# EAGLE design main (EAGLE 6.5.0)
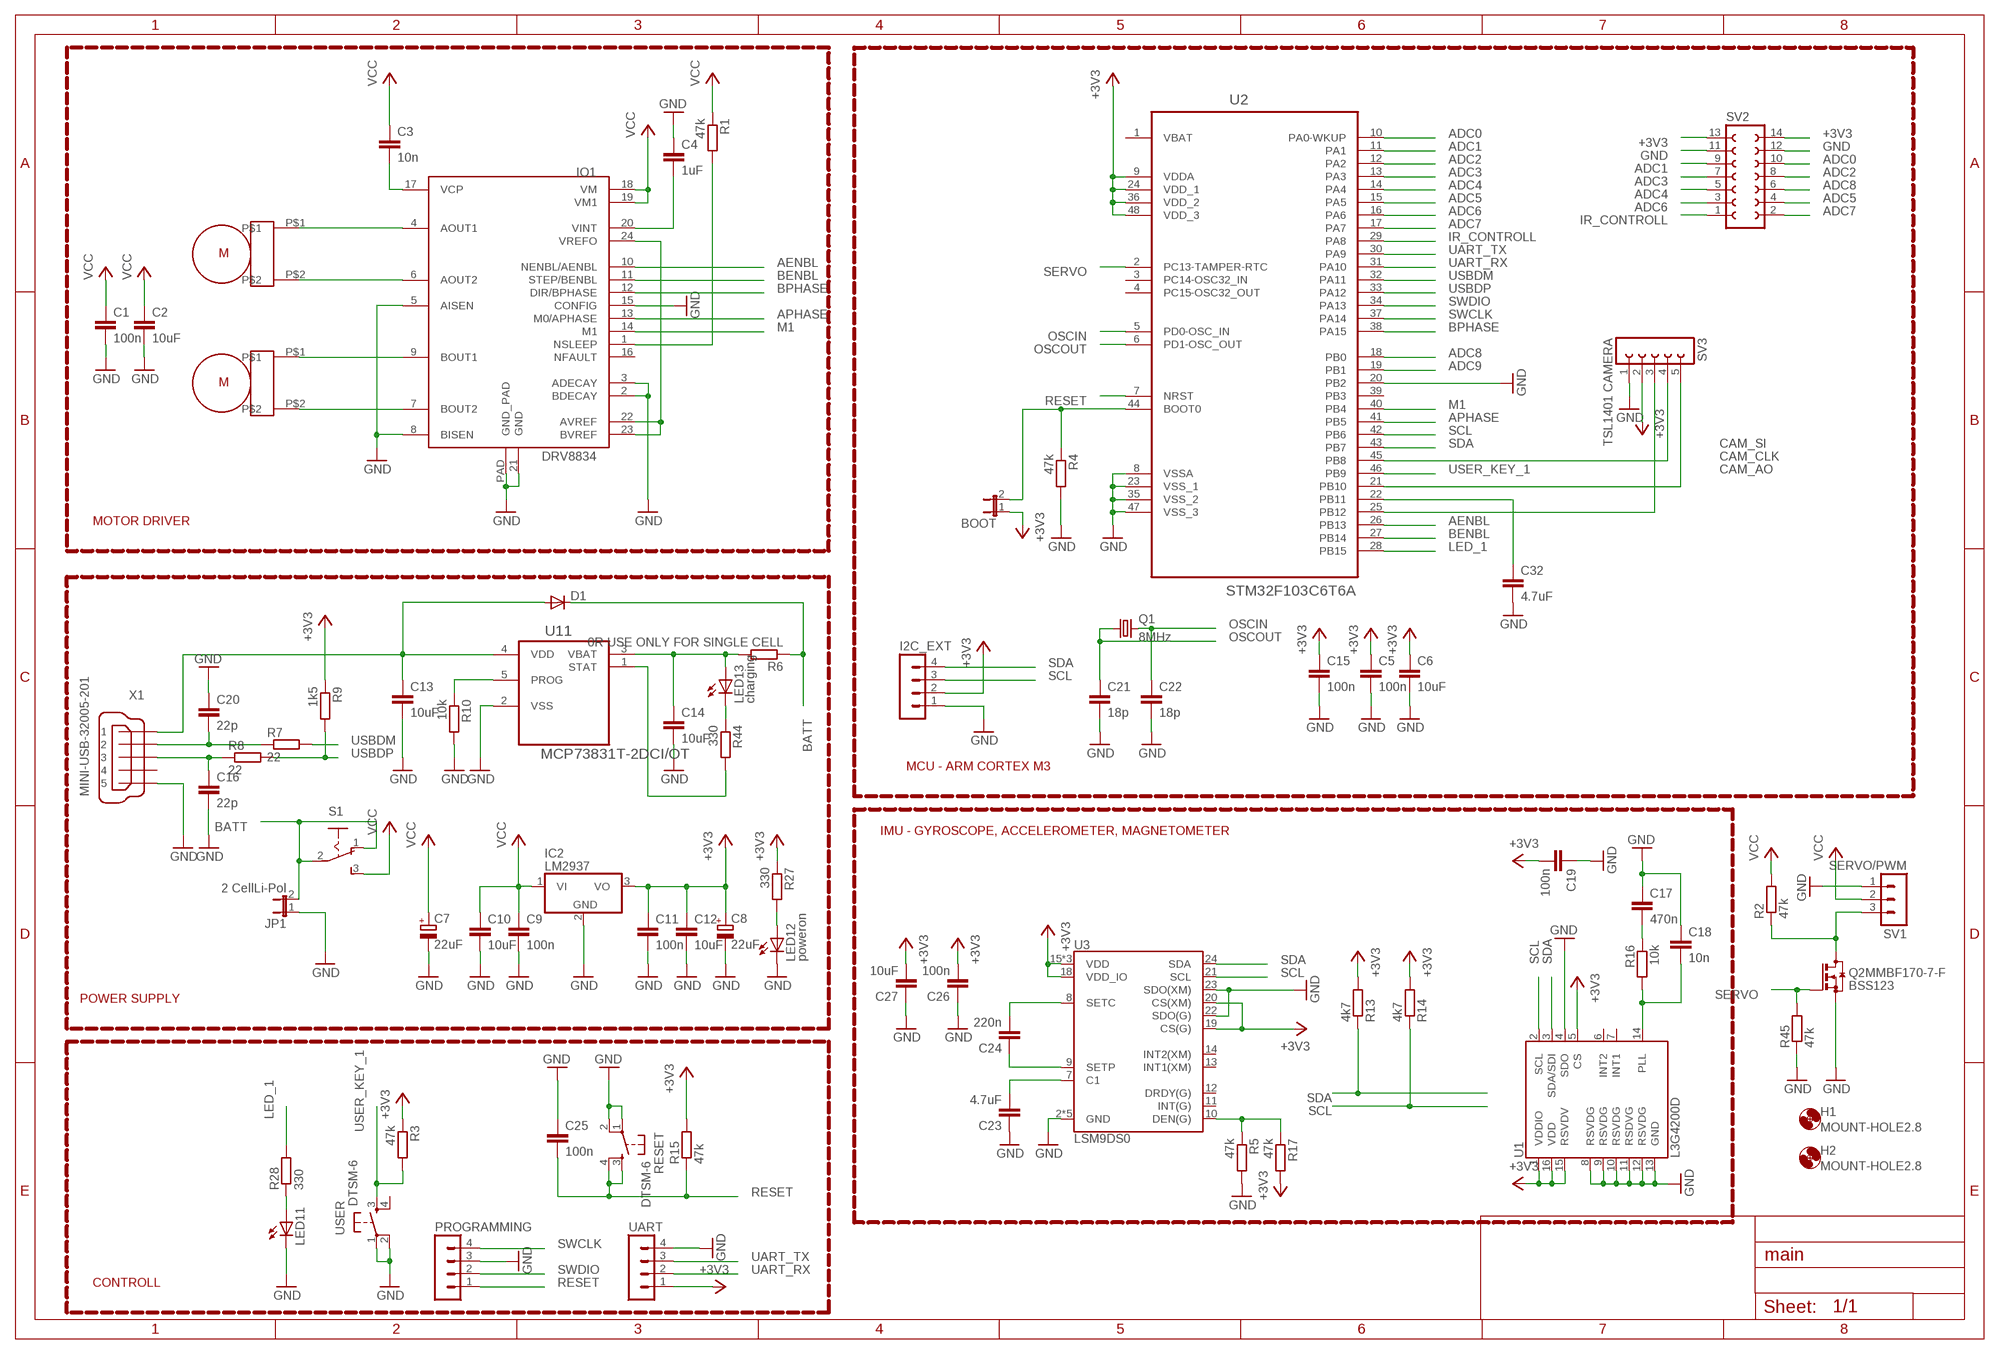
[diagram p0: schematic, sheet 1]

## Parts
BOOT  JP1E  [JP1]
C1  100n  C-EUC1206  [C1206]
C2  10uF  C-EUC1206  [C1206]
C3  10n  C-EUC1206  [C1206]
C4  1uF  C-EUC1206  [C1206]
C5  100n  C-EUC0805  [C0805]
C6  10uF  C-EUC0805  [C0805]
C7  22uF  CPOL-EU153CLV-0505  [153CLV-0505]
C8  22uF  CPOL-EU153CLV-0505  [153CLV-0505]
C9  100n  C-EUC0805  [C0805]
C10  10uF  C-EUC0805  [C0805]
C11  100n  C-EUC0805  [C0805]
C12  10uF  C-EUC0805  [C0805]
C13  10uF  C-EUC0805  [C0805]
C14  10uF  C-EUC0805  [C0805]
C15  100n  C-EUC0805  [C0805]
C16  22p  C-EUC0805  [C0805]
C17  470n  C-EUC0805  [C0805]
C18  10n  C-EUC0805  [C0805]
C19  100n  C-EUC0805  [C0805]
C20  22p  C-EUC0805  [C0805]
C21  18p  C-EUC0805  [C0805]
C22  18p  C-EUC0805  [C0805]
C23  4.7uF  C-EUC0805  [C0805]
C24  220n  C-EUC0805  [C0805]
C25  100n  C-EUC0805  [C0805]
C26  100n  C-EUC0805  [C0805]
C27  10uF  C-EUC0805  [C0805]
C32  4.7uF  C-EUC0805  [C0805]
D1  DIODE-SMB  [SMB]
H1  MOUNT-HOLE2.8  [2,8]
H2  MOUNT-HOLE2.8  [2,8]
I2C_EXT  MA04-1  [MA04-1]
IC2  LM2937  [TO263-3]
IO1  DRV8834  [DRV8834_PCK]
JP1  2 CellLi-Pol  JP1E  [JP1]
LED11  LEDCHIPLED_1206  [CHIPLED_1206]
LED12  poweron  LEDCHIPLED_1206  [CHIPLED_1206]
LED13  charging  LEDCHIPLED_1206  [CHIPLED_1206]
PROGRAMMING  MA04-1  [MA04-1]
Q1  8MHz  CRYSTALCTS406  [CTS406]
Q2MMBF170-7-F  BSS123  [SOT23]
R1  47k  R-EU_M1206  [M1206]
R2  47k  R-EU_M0805  [M0805]
R3  47k  R-EU_M0805  [M0805]
R4  47k  R-EU_M0805  [M0805]
R5  47k  R-EU_M0805  [M0805]
R6  0R USE ONLY FOR SINGLE CELL  R-EU_M1206  [M1206]
R7  22  R-EU_M0805  [M0805]
R8  22  R-EU_M0805  [M0805]
R9  1k5  R-EU_M0805  [M0805]
R10  10k  R-EU_M0805  [M0805]
R13  4k7  R-EU_M0805  [M0805]
R14  4k7  R-EU_M0805  [M0805]
R15  47k  R-EU_M0805  [M0805]
R16  10k  R-EU_M0805  [M0805]
R17  47k  R-EU_M0805  [M0805]
R27  330  R-EU_M0805  [M0805]
R28  330  R-EU_M0805  [M0805]
R44  330  R-EU_M0805  [M0805]
R45  47k  R-EU_M0805  [M0805]
RESET  DTSM-6  [DTSM-6]
S1  255SB  [255SB]
SV1  SERVO/PWM  MA03-1  [MA03-1]
SV2  FE07-2  [FE07-2]
SV3  TSL1401 CAMERA  FE05-1  [FE05-1]
U1  L3G4200D  [LGA16-4X4]
U2  STM32F103C6T6A  [QFP50P900X900X160-48N]
U3  LSM9DS0  [LGA-24]
U11  MCP73831T-2DCI/OT  [SOT95P270X145-5N]
U$1  MICRO_METAL_GEAR_MOTOR  [MICRO_METAL_GEAR_MOTOR]
U$2  MICRO_METAL_GEAR_MOTOR  [MICRO_METAL_GEAR_MOTOR]
UART  MA04-1  [MA04-1]
USER  DTSM-6  [DTSM-6]
X1  MINI-USB-32005-201  [32005-201]

## Nets
+3V3: BOOT.1 C5.1 C6.1 C8.+ C11.1 C12.1 C15.1 C19.2 C26.2 C27.2 I2C_EXT.2 IC2.3(VO) R3.1 R9.1 R13.2 R14.2 R15.2 R17.2 R27.1 SV2.13 SV2.14 SV3.2 U1.1(VDDIO) U1.5(CS) U1.15(RSVDV) U1.16(VDD) U2.9(VDDA) U2.24(VDD_1) U2.36(VDD_2) U2.48(VDD_3) U3.15(VDD) U3.16(VDD) U3.17(VDD) U3.18(VDD_IO) U3.19(CS(G)) U3.20(CS(XM)) UART.1
ADC0: SV2.10 U2.10(PA0-WKUP)
ADC1: SV2.9 U2.11(PA1)
ADC2: SV2.8 U2.12(PA2)
ADC3: SV2.7 U2.13(PA3)
ADC4: SV2.5 U2.14(PA4)
ADC5: SV2.4 U2.15(PA5)
ADC6: SV2.3 U2.16(PA6)
ADC7: SV2.2 U2.17(PA7)
ADC8: SV2.6 U2.18(PB0)
ADC9: U2.19(PB1)
AENBL: IO1.10(NENBL/AENBL) U2.26(PB13)
APHASE: IO1.13(M0/APHASE) U2.41(PB5)
BATT: D1.C JP1.2 R6.1 S1.1(O) S1.2(P)
BENBL: IO1.11(STEP/BENBL) U2.27(PB14)
BPHASE: IO1.12(DIR/BPHASE) U2.38(PA15)
CAM_AO: SV3.3 U2.25(PB12)
CAM_CLK: SV3.4 U2.45(PB8)
CAM_SI: SV3.5 U2.21(PB10)
GND: C1.2 C2.2 C4.1 C5.2 C6.2 C7.- C8.- C9.2 C10.2 C11.2 C12.2 C13.2 C14.2 C15.2 C16.2 C17.1 C18.1 C19.1 C20.1 C21.2 C22.2 C23.1 C25.1 C26.1 C27.1 C32.2 I2C_EXT.1 IC2.2(GND) IO1.2(BDECAY) IO1.3(ADECAY) IO1.5(AISEN) IO1.8(BISEN) IO1.15(CONFIG) IO1.21(GND) IO1.PAD(GND_PAD) JP1.1 LED11.C LED12.C PROGRAMMING.3 Q2MMBF170-7-F.2(S) R4.2 R5.2 R10.2 R45.1 RESET.1 RESET.2 SV1.1 SV2.11 SV2.12 SV3.1 U1.4(SDO) U1.8(RSVDG) U1.9(RSVDG) U1.10(RSVDG) U1.11(RSDVG) U1.12(RSVDG) U1.13(GND) U2.8(VSSA) U2.20(PB2) U2.23(VSS_1) U2.35(VSS_2) U2.47(VSS_3) U3.2(GND) U3.3(GND) U3.4(GND) U3.5(GND) U3.6(GND) U3.22(SDO(G)) U3.23(SDO(XM)) U11.2(VSS) UART.4 USER.1 USER.2 X1.5
IR_CONTROLL: SV2.1 U2.29(PA8)
LED_1: R28.2 U2.28(PB15)
M1: IO1.14(M1) U2.40(PB4)
N$1: IO1.4(AOUT1) U$1.P$1
N$2: IO1.6(AOUT2) U$1.P$2
N$3: IO1.9(BOUT1) U$2.P$1
N$4: IO1.7(BOUT2) U$2.P$2
N$5: C3.2 IO1.17(VCP)
N$6: C23.2 U3.7(C1)
N$7: C24.2 U3.8(SETC)
N$8: IO1.22(AVREF) IO1.23(BVREF) IO1.24(VREFO)
N$9: IO1.1(NSLEEP) R1.2
N$13: C24.1 U3.9(SETP)
N$14: C32.1 U2.22(PB11)
N$16: BOOT.2 R4.1 U2.44(BOOT0)
N$17: R44.2 U11.1(STAT)
N$18: R5.1 R17.1 U3.10(DEN(G))
N$19: C18.2 R16.2 U1.14(PLL)
N$20: C17.2 R16.1
N$22: C4.2 IO1.20(VINT)
N$23: LED12.A R27.2
N$24: LED13.C R44.1
N$26: Q2MMBF170-7-F.3(D) R2.1 SV1.3
N$33: LED11.A R28.1
N$53: C14.1 LED13.A R6.2 U11.3(VBAT)
N$54: R10.1 U11.5(PROG)
N$55: C20.2 R7.1 X1.2
N$56: C16.1 R8.1 X1.3
N$57: C13.1 D1.A U11.4(VDD) X1.1
OSCIN: C22.1 Q1.3 U2.5(PD0-OSC_IN)
OSCOUT: C21.1 Q1.1 U2.6(PD1-OSC_OUT)
RESET: C25.2 PROGRAMMING.1 R15.1 RESET.3 RESET.4 U2.7(NRST)
SCL: I2C_EXT.3 R14.1 U1.2(SCL) U2.42(PB6) U3.21(SCL)
SDA: I2C_EXT.4 R13.1 U1.3(SDA/SDI) U2.43(PB7) U3.24(SDA)
SERVO: Q2MMBF170-7-F.1(G) R45.2 U2.2(PC13-TAMPER-RTC)
SWCLK: PROGRAMMING.4 U2.37(PA14)
SWDIO: PROGRAMMING.2 U2.34(PA13)
UART_RX: U2.31(PA10) UART.2
UART_TX: U2.30(PA9) UART.3
USBDM: R7.2 U2.32(PA11)
USBDP: R8.2 R9.2 U2.33(PA12)
USER_KEY_1: R3.2 U2.46(PB9) USER.3
VCC: C1.1 C2.1 C3.1 C7.+ C9.1 C10.1 IC2.1(VI) IO1.18(VM) IO1.19(VM1) R1.1 R2.2 S1.3(S) SV1.2
Unconnected: IO1.16(NFAULT) U1.6(INT2) U1.7(INT1) U2.3(PC14-OSC32_IN) U2.4(PC15-OSC32_OUT) U2.39(PB3) U3.11(INT(G)) U3.12(DRDY(G)) U3.13(INT1(XM)) U3.14(INT2(XM)) USER.4 X1.4

## Notes on the sheet
- MOTOR DRIVER
- MCU - ARM CORTEX M3
- IMU - GYROSCOPE, ACCELEROMETER, MAGNETOMETER
- POWER SUPPLY
- CONTROLL

## Power pins joined to a net without a drawn wire
VBAT: U2.1(VBAT)

## Library data of the parts
BOOT JP1 = jumper:JP1E: JUMPER
C1-C6 C9-C27 C32 = resistor:C-EU: CAPACITOR, European symbol
C7 C8 = resistor:CPOL-EU: POLARIZED CAPACITOR, European symbol
D1 = diode:DIODE-: DIODE
H1 H2 = holes:MOUNT-HOLE: MOUNTING HOLE with drill center marker
I2C_EXT PROGRAMMING UART = con-lstb:MA04-1: PIN HEADER; OC_FARNELL: unknown; OC_NEWARK: unknown
IC2 = linear:LM2937: LM2937-2.5, LM2937-3.3 400mA and 500mA Voltage Regulators Source: http://cache.national.com/ds/LM/LM2937-2.5.pdf
IO1 = yellow_car:DRV8834
LED11-LED13 = led:LED: LED OSRAM: - CHIPLED LG R971, LG N971, LY N971, LG Q971, LY Q971, LO R971, LY R971 LH N974, LH R974 LS Q976, LO Q976, LY Q976 LO Q996 - Hyper CHIPLED LW Q18S LB Q993, LB Q99A, LB R99A - SideLED LS A670, LO A670, LY A670, LG A670, LP A670 LB A673, LV A673, LT A673, LW A673 LH A674 LY A675 LS A676, LA A676, LO A676, LY A676, LW A676 LS A679, LY A679, LG A679 - Hyper Micro SIDELED® LS Y876, LA Y876, LO Y876, LY Y876 LT Y87S - SmartLED LW L88C, LW L88S LB L89C, LB L89S, LG L890 LS L89K, LO L89K, LY L89K LS L896, LA L896, LO L896, LY L896 - TOPLED LS T670, LO T670, LY T670, LG T670, LP T670 LSG T670, LSP T670, LSY T670, LOP T670, LYG T670 LG T671, LOG T671, LSG T671 LB T673, LV T673, LT T673, LW T673 LH T674 LS T676, LA T676, LO T676, LY T676, LB T676, LH T676, LSB T676, LW T676 LB T67C, LV T67C, LT T67C, LS T67K, LO T67K, LY T67K, LW E67C LS E67B, LA E67B, LO E67B, LY E67B, LB E67C, LV E67C, LT E67C LW T67C LS T679, LY T679, LG T679 LS T770, LO T770, LY T770, LG T770, LP T770 LB T773, LV T773, LT T773, LW T773 LH T774 LS E675, LA E675, LY E675, LS T675 LS T776, LA T776, LO T776, LY T776, LB T776 LHGB T686 LT T68C, LB T68C - Hyper Mini TOPLED® LB M676 - Mini TOPLED Santana® LG M470 LS M47K, LO M47K, LY M47K Source: http://www.osram.convergy.de LUXEON: - LUMILED® LXK2-PW12-R00, LXK2-PW12-S00, LXK2-PW14-U00, LXK2-PW14-V00 LXK2-PM12-R00, LXK2-PM12-S00, LXK2-PM14-U00 LXK2-PE12-Q00, LXK2-PE12-R00, LXK2-PE12-S00, LXK2-PE14-T00, LXK2-PE14-U00 LXK2-PB12-K00, LXK2-PB12-L00, LXK2-PB12-M00, LXK2-PB14-N00, LXK2-PB14-P00, LXK2-PB14-Q00 LXK2-PR12-L00, LXK2-PR12-M00, LXK2-PR14-Q00, LXK2-PR14-R00 LXK2-PD12-Q00, LXK2-PD12-R00, LXK2-PD12-S00 LXK2-PH12-R00, LXK2-PH12-S00 LXK2-PL12-P00, LXK2-PL12-Q00, LXK2-PL12-R00 Source: www.luxeon.com KINGBRIGHT: KA-3528ASYC Source: www.kingbright.com
Q1 = crystal:CRYSTAL: CRYSTAL; OC_FARNELL: unknown; OC_NEWARK: unknown
Q2MMBF170-7-F = transistor-small-signal:BSS123: N-CHANNEL MOS FET
R1-R10 R13-R17 R27 R28 R44 R45 = resistor:R-EU_: RESISTOR, European symbol
RESET USER = switch-tact:DTSM-6
S1 = switch:255SB: SLIDING SWITCH Distributor Buerklin, 11G810
SV1 = con-lstb:MA03-1: PIN HEADER; OC_FARNELL: unknown; OC_NEWARK: unknown
SV2 = con-lsta:FE07-2: FEMALE HEADER; OC_FARNELL: unknown; OC_NEWARK: unknown
SV3 = con-lsta:FE05-1: FEMALE HEADER; OC_FARNELL: unknown; OC_NEWARK: unknown
U1 = my_parts:L3G4200D: L3G4200D Three-axis, digital output gyroscope The L3G4200D is a low-power three-axis angular rate sensor, has a full scale of ±250/±500/±2000 dps and is capable of measuring rates with a user-selectable bandwidth. It includes a sensing element and an IC interface capable of providing the measured angular rate to the external world through a digital interface (I2C/SPI). Package: 4x4x1.1 LGA-16 (LGA16-4x4.PAC)
U2 = stm32f103_lqfp48:STM32F103C6T6A: MCU, 32BIT, 32K FLASH, 48LQFP; MPN: STM32F103C6T6A; OC_FARNELL: 1972391; OC_NEWARK: 72T2643; PACKAGE: 48LQFP; SUPPLIER: STMicroelectronics
U3 = SparkFun-DigitalIC:LSM9DS0: LSM9DS0 3D Accelerometer, 3D Gyroscope, 3D Magnetomter Features: 3 acceleration channels, 3 angular rate channels, 3 magnetic field channels ±2/±4/±6/±8/±16 g linear acceleration full scale ±2/±4/±8/±12 gauss magnetic full scale ±245/±500/±2000 dps angular rate full scale 16-bit data output SPI / I2C serial interfaces Analog supply voltage 2.4 V to 3.6 V Power-down mode / low-power mode Programmable interrupt generators Embedded self-test Embedded temperature sensor Embedded FIFO Position and motion detection functions Click/double-click recognition
U11 = Microchip-MCP73831T-2DCI_OT:MCP73831T-2DCI/OT: Li-Polymer Charge Management Controllers, SOT23-5; MPN: MCP73831T-2DCI/OT; OC_FARNELL: 1840935; OC_NEWARK: 84R6271; PACKAGE: SOT23-5; SUPPLIER: Microchip
U$1 U$2 = pololu:MICRO_METAL_GEAR_MOTOR
X1 = con-cypressindustries:MINI-USB-: MINI USB-B Conector Source: www.cypressindustries.com; OC_FARNELL: unknown; OC_NEWARK: unknown

## Board
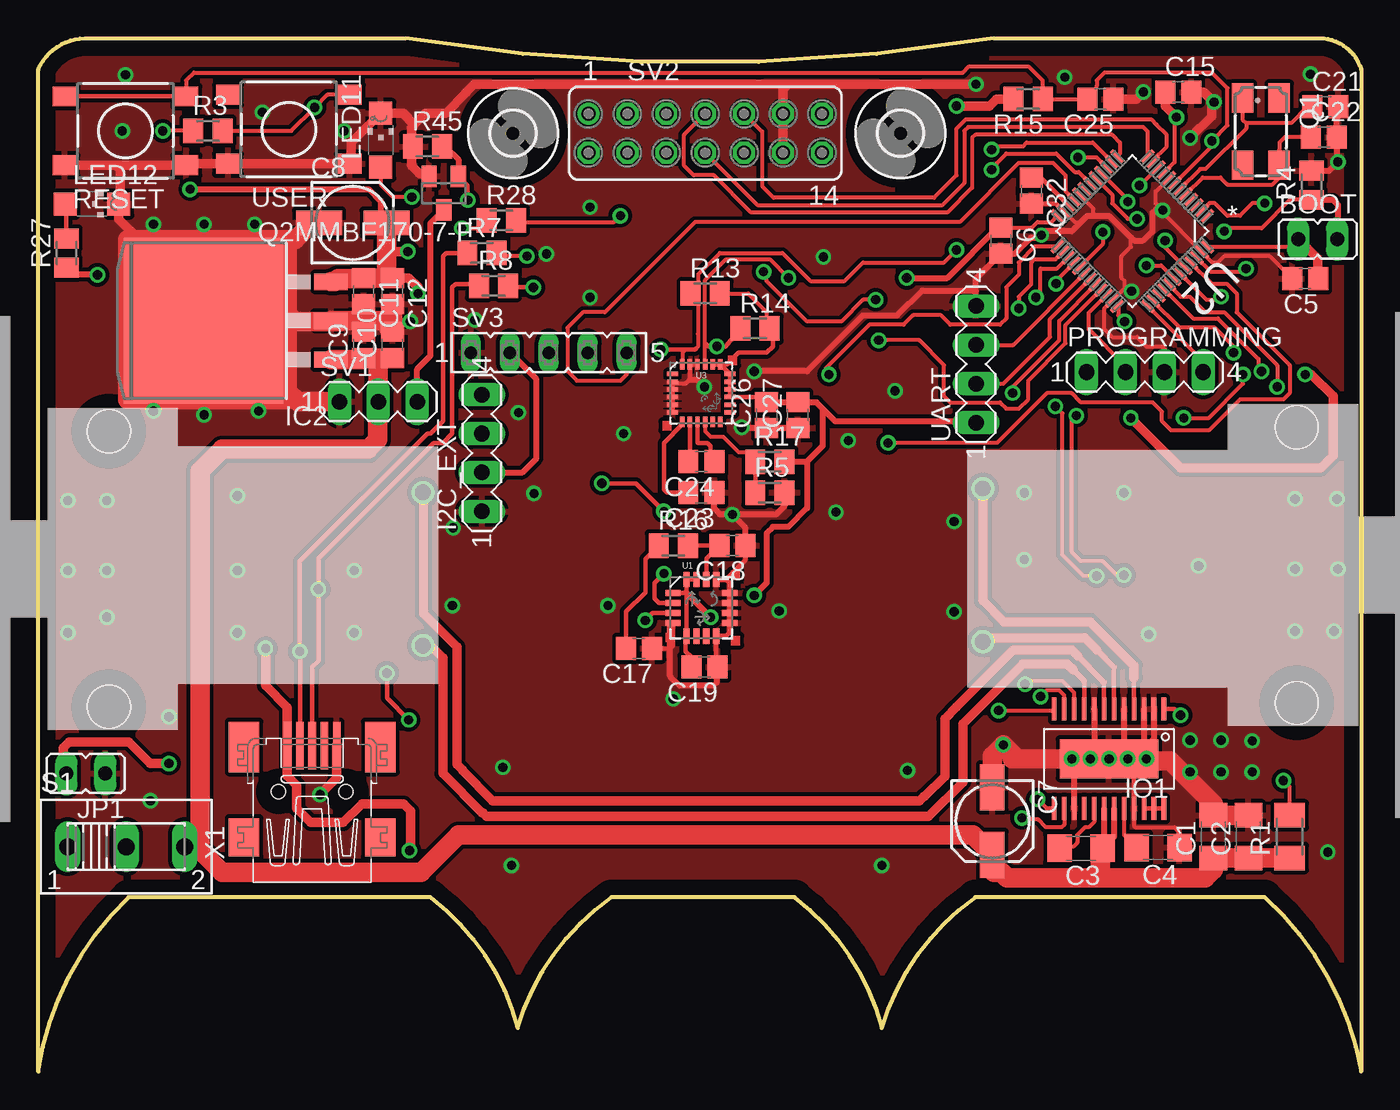
[diagram p1: board, top side]
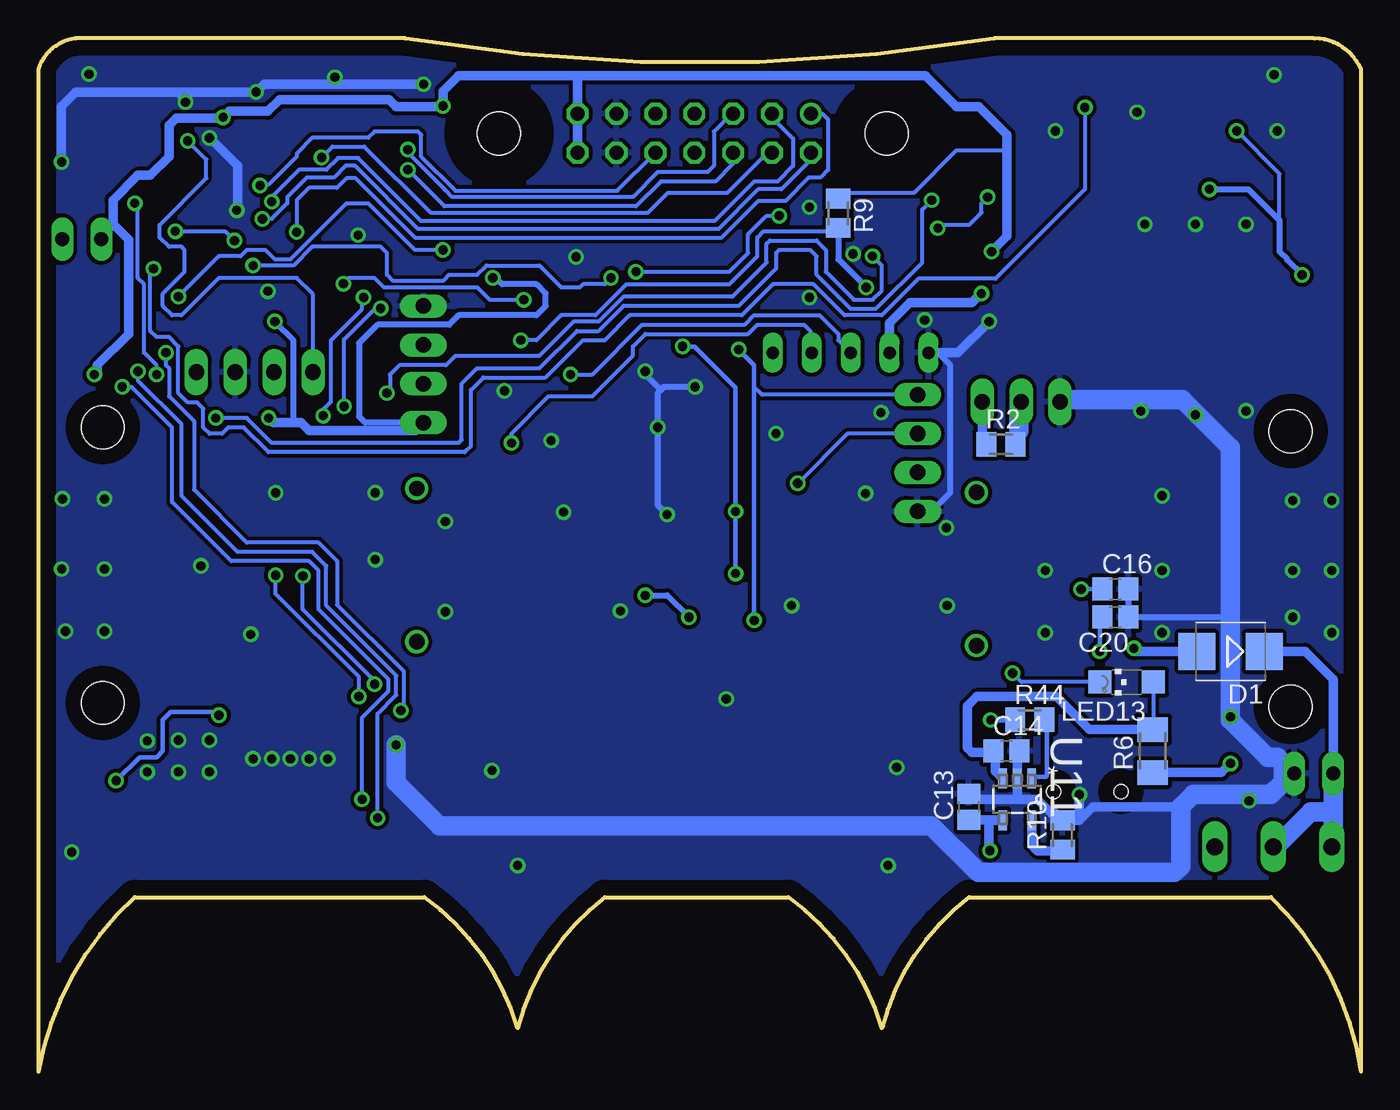
[diagram p2: board, bottom side, seen from below]

Size 86.36 x 67.46 mm. Coordinates in mm from the lower left corner, seen from the top.
Outline: 3.05,67.46 23.98,67.46 arc19 62.38,67.46 83.92,67.46 arc-66 86.36,65.43 86.36,0 arc38 80.06,11.38 61.16,11.38 arc38 55.07,2.85 arc38 49.38,11.38 37.39,11.38 arc38 31.29,2.85 arc38 25.6,11.38 5.89,11.38 arc38 0,0 0,65.43 arc-66 3.05,67.46
Copper layers (1*16): Top 0.035mm / dielectric 1.5mm / Bottom 0.035mm
Design rules "default *": minimum track width 10mil, minimum drill 24mil, track to track 10mil, track to pad 10mil, pad to pad 10mil, via to via 10mil, smd to smd 10mil, copper to edge 40mil, drill to drill 8mil, minimum pad ring 10mil, minimum via ring 8mil, stop-mask expansion 4mil, vias tented up to drill 0mil, thermal gap 10mil

### Footprints (pad centres in the part's own frame; a part is rotated, then mirrored left to right if it is on the bottom)
JP1 = drill 0.914 long: 1 0,-1.27; 2 0,1.27
C1206 = smd 1.6 x 1.8: 1 -1.4,0; 2 1.4,0
C0805 = smd 1.3 x 1.5: 1 -0.85,0; 2 0.85,0
153CLV-0505 = smd 3 x 1.6: + 2.2,0; - -2.2,0
SMB = smd 2.4 x 2.4: A 2.2,0; C -2.2,0
2,8 = hole 2.8: 0,0
MA04-1 = drill 1.016 long: 1 -3.81,0; 2 -1.27,0; 3 1.27,0; 4 3.81,0
TO263-3 = smd 1.067 x 2.159: 1 -2.54,-5.791; 2 0,-5.791; 3 2.54,-5.791 | smd 10.8 x 10.41: TAB 0,2.54
DRV8834_PCK = smd 0.3 x 1.5: 1 -3.575,-3.25; 2 -2.925,-3.25; 3 -2.275,-3.25; 4 -1.625,-3.25; 5 -0.975,-3.25; 6 -0.325,-3.25; 7 0.325,-3.25; 8 0.975,-3.25; 9 1.625,-3.25; 10 2.275,-3.25; 11 2.925,-3.25; 12 3.575,-3.25; 13 3.575,3.25; 14 2.925,3.25; 15 2.275,3.25; 16 1.625,3.25; 17 0.975,3.25; 18 0.325,3.25; 19 -0.325,3.25; 20 -0.975,3.25; 21 -1.625,3.25; 22 -2.275,3.25; 23 -2.925,3.25; 24 -3.575,3.25 | smd 6.452 x 2.54: PAD 0,0
CHIPLED_1206 = smd 1.5 x 1.5: A 0,-1.75; C 0,1.75
CTS406 = smd 1.9 x 1.4: 1 -2.2,-1.2; 2 2.2,-1.2; 3 2.2,1.2; 4 -2.2,1.2
SOT23 = smd 1 x 1.4: 1 -0.95,-1.1; 2 0.95,-1.1; 3 0,1.1
M1206 = smd 1.6 x 2: 1 -1.4,0; 2 1.4,0
M0805 = smd 1.3 x 1.6: 1 -0.95,0; 2 0.95,0
DTSM-6 = smd 1.55 x 1.3: 1 -3.975,2.25; 2 3.975,2.25; 3 -3.975,-2.25; 4 3.975,-2.25
255SB = drill 1.118 long: 1 -3.81,0; 2 0,0; 3 3.81,0
MA03-1 = drill 1.016 long: 1 -2.54,0; 2 0,0; 3 2.54,0
FE07-2 = drill 0.914: 1 -7.62,1.27 | drill 0.914 octagon: 2 -7.62,-1.27; 3 -5.08,1.27; 4 -5.08,-1.27; 5 -2.54,1.27; 6 -2.54,-1.27; 7 0,1.27; 8 0,-1.27; 9 2.54,1.27; 10 2.54,-1.27; 11 5.08,1.27; 12 5.08,-1.27; 13 7.62,1.27; 14 7.62,-1.27
FE05-1 = drill 0.813 long: 1 -5.08,0; 2 -2.54,0; 3 0,0; 4 2.54,0; 5 5.08,0
LGA16-4X4 = smd 1 x 0.4: 1 -1.85,0.975; 2 -1.85,0.325; 3 -1.85,-0.325; 4 -1.85,-0.975; 9 1.85,-0.975; 10 1.85,-0.325; 11 1.85,0.325; 12 1.85,0.975 | smd 0.4 x 1: 5 -0.975,-1.85; 6 -0.325,-1.85; 7 0.325,-1.85; 8 0.975,-1.85; 13 0.975,1.85; 14 0.325,1.85; 15 -0.325,1.85; 16 -0.975,1.85
QFP50P900X900X160-48N = smd 1.041 x 0.279: 1 -4.166,2.743; 2 -4.166,2.261; 3 -4.166,1.753; 4 -4.166,1.245; 5 -4.166,0.762; 6 -4.166,0.254; 7 -4.166,-0.254; 8 -4.166,-0.762; 9 -4.166,-1.245; 10 -4.166,-1.753; 11 -4.166,-2.261; 12 -4.166,-2.743; 25 4.166,-2.743; 26 4.166,-2.261; 27 4.166,-1.753; 28 4.166,-1.245; 29 4.166,-0.762; 30 4.166,-0.254; 31 4.166,0.254; 32 4.166,0.762; 33 4.166,1.245; 34 4.166,1.753; 35 4.166,2.261; 36 4.166,2.743 | smd 0.279 x 1.041: 13 -2.743,-4.166; 14 -2.261,-4.166; 15 -1.753,-4.166; 16 -1.245,-4.166; 17 -0.762,-4.166; 18 -0.254,-4.166; 19 0.254,-4.166; 20 0.762,-4.166; 21 1.245,-4.166; 22 1.753,-4.166; 23 2.261,-4.166; 24 2.743,-4.166; 37 2.743,4.166; 38 2.261,4.166; 39 1.753,4.166; 40 1.245,4.166; 41 0.762,4.166; 42 0.254,4.166; 43 -0.254,4.166; 44 -0.762,4.166; 45 -1.245,4.166; 46 -1.753,4.166; 47 -2.261,4.166; 48 -2.743,4.166
LGA-24 = smd 0.7 x 0.29: 1 -1.875,1.25; 2 -1.875,0.75; 3 -1.875,0.25; 4 -1.875,-0.25; 5 -1.875,-0.75; 6 -1.875,-1.25; 13 1.875,-1.25; 14 1.875,-0.75; 15 1.875,-0.25; 16 1.875,0.25; 17 1.875,0.75; 18 1.875,1.25 | smd 0.29 x 0.7: 7 -1.25,-1.875; 8 -0.75,-1.875; 9 -0.25,-1.875; 10 0.25,-1.875; 11 0.75,-1.875; 12 1.25,-1.875; 19 1.25,1.875; 20 0.75,1.875; 21 0.25,1.875; 22 -0.25,1.875; 23 -0.75,1.875; 24 -1.25,1.875
SOT95P270X145-5N = smd 1.321 x 0.559: 1 -1.372,0.94; 2 -1.372,0; 3 -1.372,-0.94; 4 1.372,-0.94; 5 1.372,0.94
MICRO_METAL_GEAR_MOTOR = drill 1: P$1 -5,1; P$2 5,1 | hole 2.8: -9,21.5; 9,21.5
32005-201 = smd 3.1 x 0.5: 1 3,1.6; 2 3,0.8; 3 3,0; 4 3,-0.8; 5 3,-1.6 | smd 2.5 x 2: M1 -3,-4.45; M2 -3,4.45 | smd 3.3 x 2: M3 2.9,4.45; M4 2.9,-4.45 | hole 0.9: 0,2.2; 0,-2.2

### Placement (x,y rotation side)
BOOT  83.52,54.36 270 top
C1  76.71,15.34 90 top
C2  78.99,15.34 90 top
C3  68.07,14.58 180 top
C4  73.1,14.63 180 top
C5  82.7,51.77 180 top
C6  62.84,54.25 270 top
C7  62.28,16.36 270 top
C8  20.52,55.42 0 top
C9  21.23,47.45 90 top
C10  23.11,47.45 90 top
C11  21.23,50.95 270 top
C12  23.11,50.95 270 top
C13  25.6,17.27 90 bottom
C14  23.16,20.93 0 bottom
C15  74.42,63.96 0 top
C16  16.05,31.5 0 bottom
C17  39.22,27.64 180 top
C18  45.31,34.34 180 top
C19  43.48,26.42 180 top
C20  16.05,29.67 180 bottom
C21  84.02,62.99 0 top
C22  83.92,61.01 0 top
C23  43.28,37.8 180 top
C24  43.28,39.83 180 top
C25  69.34,63.5 180 top
C26  47.55,42.88 90 top
C27  49.58,42.88 90 top
C32  64.82,57.51 270 top
D1  8.53,27.43 180 bottom
H1  30.99,61.26 0 top
H2  56.29,61.26 0 top
I2C_EXT  28.96,40.39 90 top
IC2  13.31,49.02 90 top
IO1  69.9,20.42 180 top
JP1  3.1,19.46 90 top
LED11  22.35,60.81 0 top
LED12  3.51,56.64 270 top
LED13  15.32,25.43 90 bottom
PROGRAMMING  72.24,45.67 0 top
Q1  79.81,61.37 270 top
Q2MMBF170-7-F  26.47,57.35 180 top
R1  81.69,15.34 90 top
R2  23.52,40.94 0 bottom
R3  11.07,61.42 0 top
R4  83.11,57.86 90 top
R5  47.75,37.8 0 top
R6  13.61,20.93 90 bottom
R7  28.96,53.44 0 top
R8  29.72,51.31 0 top
R9  34.14,56.03 270 bottom
R10  19.51,15.44 90 bottom
R13  43.54,50.8 0 top
R14  46.79,48.51 0 top
R15  64.62,63.5 180 top
R16  41.45,34.34 0 top
R17  47.75,39.83 0 top
R27  1.83,53.44 90 top
R28  30.23,55.58 0 top
R44  21.64,22.96 0 bottom
R45  25.4,60.4 0 top
RESET  5.69,61.42 180 top
S1  5.74,14.68 0 top
SV1  22.2,43.74 0 top
SV2  43.54,61.26 0 top
SV3  33.32,46.94 0 top
U1  43.28,30.28 0 top
U2  71.42,54.86 225 top
U3  43.28,44.3 0 top
U11  22.45,17.78 270 bottom
U$1  60.66,33.07 270 top
U$2  26.11,32.82 90 top
UART  61.21,46.18 90 top
USER  16.36,61.52 180 top
X1  17.88,18.29 90 top

### Tracks (layer width: path | path; a pad name or v marks a point on that pad's centre or on a via)
+3V3  (via drill 0.6)
  Top 0.254: 1.89,52.43 R27.1 | R3.1 v8.13,61.42 | U2.36 70.5,49.98 70.5,49.39 v70.92,48.97 | U2.48 81.75,53.86 BOOT.1 82.25,54.31 | 83.52,51.8 C5.1 | U2.9 74.17,59.37 74.17,62.18 v74.3,62.31 | 47.35,48.12 R14.2 47.55,48.7 47.55,49.58 46.33,50.8 R13.2 | 66.33,56.08 U2.24 66.14,55.47 65.23,55.47 64.86,55.1 C6.1
  Top 0.305: 22.1,55.32 22.35,55.07 22.37,55.07 C8.+ | U3.20 U3.19 | U3.19 U3.18 U3.17 U3.16 U3.15 47.43,44.05 C26.2 | C19.2 42.63,27.06 42.27,27.43 42.27,28.39 U1.5 42.31,31.29 | 42.31,31.29 U1.16 U1.15 | 42.31,31.29 42.27,31.25 U1.1 | U3.19 44.95,46.17 45.72,46.94 47.55,46.94 47.95,47.35 47.95,48.3 R14.2
  Top 0.406: v9.91,57.61 21.59,57.61 22.35,56.85 22.35,55.79 C8.+ | C26.2 C27.2 49.62,43.69 50.8,43.69 51.21,43.28 | R17.2 50.19,39.83 | 51.21,43.28 51.21,40.84 50.19,39.83 | 50.19,39.83 50.19,36.78 48.97,35.56 47.95,35.56 47.55,35.15 47.55,31.9 v46.74,31.09 | 51.21,43.28 52.02,42.47 61.11,42.47 UART.1 | 42.27,31.25 42.31,31.25 v43.89,29.67 | v3.86,52.02 2.3,52.02 R27.1 | C6.1 62.62,55.1 59.33,51.82 v56.69,51.82 | I2C_EXT.2 31.6,39.12 32.51,40.03 32.51,45.21 SV3.2
  Top 0.61: v24.13,53.54 22.72,53.54 | R15.2 62.54,63.5 62.08,63.04 v59.94,63.04 | 71.53,42.67 v71.32,42.67 74.57,39.42 83.72,39.42 84.53,40.23 84.53,44.09 83.11,45.52 v82.7,45.52 | v24.79,50.8 24.79,51.21 24.18,51.82 23.13,51.82 C12.1 | C15.1 73.57,63.03 v74.3,62.31 | 83.52,51.8 83.52,53.09 BOOT.1
  Top 1.27: IC2.3 19.35,51.56 19.56,51.77 21.2,51.77 C11.1 C12.1 22.72,52.19 22.72,53.54 C8.+
  Bottom 0.254: 5.33,55.58 5.33,58.62 v8.13,61.42 | 51.1,63.45 51.16,63.4 | 33.73,57.39 29.17,57.39 26.42,60.15 23.32,60.15 23.11,60.35 | 69.7,42.47 69.49,42.27
  Bottom 0.305: 69.49,42.27 69.49,42.37
  Bottom 0.406: v9.91,57.61 7.37,57.61 5.33,55.58 5.33,53.54 4.83,53.04 4.83,52.98 v3.86,52.02 | UART.1 65.02,42.37 65.43,42.77 65.43,47.55 64.21,48.77 59.54,48.77 58.93,49.38 53.85,49.38 53.24,49.99 53.24,50.8 53.85,51.41 56.08,51.41 56.49,51.82 v56.69,51.82 | 33.73,57.39 R9.1 | 82.14,54.46 BOOT.1 | v46.74,31.09 45.31,31.09 v43.89,29.67 | 69.7,42.47 69.7,47.75 v70.92,48.97
  Bottom 0.61: v24.13,53.54 23.11,54.56 23.11,60.35 23.11,61.16 24.94,62.99 26.42,62.99 28.45,65.02 51.21,65.02 | SV2.14 SV2.13 51.16,63.4 51.16,64.97 51.21,65.02 | 81.48,55.32 81.48,56.9 79.86,58.52 79.05,58.52 77.83,59.74 77.83,61.77 77.34,62.26 74.35,62.26 v74.3,62.31 73.91,62.69 71.37,62.69 70.61,63.45 63.45,63.45 62.99,62.99 59.99,62.99 v59.94,63.04 59.94,64.01 58.93,65.02 51.21,65.02 | 81.48,55.32 82.09,54.71 82.09,54.51 BOOT.1 | v71.32,42.67 71.02,42.37 69.49,42.37 69.19,42.37 68.68,41.86 61.72,41.86 UART.1 | 81.48,55.32 80.47,54.31 80.47,48.16 82.5,46.13 82.5,45.72 v82.7,45.52 | SV3.2 30.78,48.87 29.46,50.19 25.4,50.19 v24.79,50.8
ADC0  (via drill 0.6)
  Top 0.254: v71.88,57.86 71.94,57.86 U2.10
  Bottom 0.254: v71.88,57.86 71.83,57.91 71.32,57.91 69.49,59.74 69.49,59.94 68.48,60.96 64.82,60.96 64.41,61.37 61.57,61.37 61.37,61.16 61.37,59.74 59.13,57.51 48.56,57.51 SV2.10
ADC1
  Top 0.254: U2.11 72.77,59.51 73.66,60.4 73.66,61.16 73,61.82 72.64,62.18 60.55,62.18 59.94,61.57 59.94,58.52 58.47,57.05 48.01,57.05 47.24,57.81 47.24,61.37 SV2.9
ADC2
  Top 0.254: U2.12 72.43,61.38 72.14,61.67 60.71,61.67 60.45,61.42 60.45,58.01 58.98,56.54 46.99,56.54 SV2.8
ADC3
  Top 0.254: U2.13 70.61,59.94 70.61,60.66 70.1,61.16 61.16,61.16 60.96,60.96 60.96,57.71 59.33,56.08 46.53,56.08 44.09,58.52 42.77,58.52 42.16,59.13 42.16,61.16 SV2.7
ADC4  (via drill 0.6)
  Top 0.254: U2.14 68.83,60.66 64.52,60.66 64.26,60.4 62.43,60.4 v62.23,60.2
  Bottom 0.254: v62.23,60.2 62.23,60 59.84,57.61 59.74,57.51 59.33,57.1 47.55,57.1 45.92,58.73 42.67,58.73 42.27,59.13 42.27,61.37 41.1,62.54 SV2.5
ADC5  (via drill 0.6)
  Top 0.254: v67.87,59.69 69.08,59.69 U2.15
  Bottom 0.254: SV2.4 38.76,60 41.4,57.35 45.27,57.35 46.54,56.08 60.76,56.08 65.08,60.4 67.16,60.4 v67.87,59.69
ADC6  (via drill 0.6)
  Top 0.254: v71.12,56.79 71.12,56.93 U2.16
  Bottom 0.254: SV2.3 38.46,62.28 37.08,60.91 37.08,59.13 38.1,58.12 39.62,58.12 42.21,55.52 61.37,55.52 65.48,59.64 66.8,59.64 67.56,58.88 69.34,58.88 71.12,57.1 v71.12,56.79
ADC7  (via drill 0.6)
  Top 0.254: U2.17 70.1,57.26 70.1,56.69 71.12,55.68 v71.73,55.68
  Bottom 0.254: SV2.2 35.92,59.54 37.85,57.61 39.37,57.61 41.96,55.02 61.57,55.02 65.68,59.13 66.29,59.13 67.06,58.37 68.83,58.37 70.1,57.1 70.1,56.69 71.12,55.68 v71.73,55.68
ADC8  (via drill 0.6)
  Top 0.254: U2.18 67.92,58.73 67.67,58.73 66.45,59.94 63.2,59.94 62.54,59.28 62.54,59.18 v62.23,58.88
  Bottom 0.254: SV2.6 41,59.28 42.16,58.12 45.72,58.12 47.35,56.49 59.84,56.49 v62.23,58.88
AENBL  (via drill 0.6)
  Top 0.254: IO1.10 67.63,24.73 66.85,25.5 64.62,25.5 v64.41,25.3 | U2.26 66.4,53.04 65.02,53.04 64.82,52.83 64.82,51.41 64.01,50.6 v64.01,49.84 | v69.09,32.36 68.22,32.36 66.85,33.73 66.85,42.98 v66.4,43.43
  Bottom 0.254: v64.41,25.3 64.41,25.5 69.09,30.18 v69.09,32.36 | v66.4,43.43 66.4,47.8 64.21,49.99 64.16,49.99 v64.01,49.84
APHASE  (via drill 0.6)
  Top 0.254: IO1.13 65.84,17.17 v65.23,17.78 | U2.41 73.83,51.34 74.57,50.6 75.18,50.6 76.2,49.58 77.42,49.58 80.87,46.13 v80.87,44.7
  Bottom 0.254: v65.23,17.78 65.23,23.11 63.5,24.84 63.5,25.6 68.07,30.18 68.07,32.72 68.68,33.33 73.76,33.33 77.62,37.19 77.62,42.06 80.26,44.7 v80.87,44.7
BATT  (via drill 0.6)
  Top 0.61: v8.53,20.12 7.31,20.12 5.89,21.54 2.03,21.54 1.63,21.13 1.63,19.66 JP1.2
  Bottom 0.61: R6.1 9.12,19.53 v8.53,20.12 | D1.C 3.66,27.43 1.83,25.6 JP1.2
  Bottom 1.27: JP1.2 1.83,16.97 | 1.83,16.97 1.83,14.78 S1.1 | S1.2 5.59,14.68 3.3,16.97 1.83,16.97
BENBL  (via drill 0.6)
  Top 0.254: IO1.11 66.98,24.57 66.65,24.89 65.84,24.89 v65.43,24.49 | v65.13,50.55 65.18,50.55 65.43,50.8 65.43,52.43 66.51,52.43 U2.27 | v70.87,32.41 70.41,32.41 69.49,33.33 68.07,33.33 67.46,33.93 67.46,42.52 v67.77,42.82
  Bottom 0.254: v65.43,24.49 65.43,25.76 70.87,31.19 v70.87,32.41 | v65.13,50.55 65.23,50.44 65.23,49.78 67.26,47.75 67.26,43.74 67.77,43.23 v67.77,42.82
BPHASE  (via drill 0.6)
  Top 0.254: 66.33,23.55 IO1.12 66.23,23.57 v62.69,23.57 | v78.03,46.94 78.03,47.35 76.81,48.57 74.53,48.57 U2.38
  Bottom 0.254: v62.69,23.57 62.69,23.88 62.48,24.08 62.48,26.11 66.85,30.48 66.85,33.33 68.07,34.54 72.75,34.54 76.2,38 76.2,42.47 77.83,44.09 77.83,45.92 78.03,46.13 v78.03,46.94
CAM_AO  (via drill 0.6)
  Top 0.254: U2.25 65.03,53.86 64.01,52.83 64.01,52.02 63.2,51.21 63.2,49.17 62.79,48.77 59.54,48.77 58.93,49.38 57.1,49.38 56.49,48.77 54.25,48.77 51.41,45.92 51.41,45.72 v51.61,45.52
  Bottom 0.254: v51.61,45.52 50.19,45.52 46.94,48.77 40.23,48.77 39.62,49.38 35.36,49.38 34.14,48.16 34.14,47.75 SV3.3
CAM_CLK  (via drill 0.6)
  Top 0.254: 75.25,52.77 U2.45 76.64,51.41 77.62,51.41 78.23,50.8 78.23,49.58 81.69,46.13 81.69,44.3 81.28,43.89 78.44,43.89 76.4,41.86 73.97,41.86 73.36,42.47 73.36,43.08 72.75,43.69 68.07,43.69 67.46,44.3 65.84,44.3 62.59,41.05 v55.47,41.05
  Bottom 0.254: v55.47,41.05 55.47,41.66 53.03,44.09 50.19,44.09 47.55,46.74 47.55,47.35 46.74,48.16 40.03,48.16 39.42,48.77 36.37,48.77 35.97,48.36 35.97,47.04 SV3.4
CAM_SI
  Top 0.254: 67.6,56.96 U2.21 67.06,57.47 67.06,58.52 66.24,59.33 64.01,59.33 60.15,55.47 42.88,55.47 36.98,49.58 35.56,49.58 34.54,48.57 34.54,45.72 35.15,45.11 38,45.11 38.41,45.52 SV3.5
GND  (via drill 0.6)
  Top 0.254: 72.18,20.46 72.3,20.46 v72.34,20.42 | v68.68,20.42 v67.46,20.42 | IO1.21 71.53,16.05 71.63,15.95 74.17,15.95 74.42,15.7 74.42,14.71 C4.1 | U2.47 | U2.8 72.95,57.47 72.95,56.69 73.15,56.49 73.15,56.33 73.28,56.21 | U2.23 66.93,56.21 67.67,55.47 68.07,55.47 | U2.35 70.08,50.37 | U2.35 70.92,51.16 70.92,51.61 70.71,51.82 70.71,53.24 71.32,53.85 71.32,54.46 | U2.35 69.6,49.84 69.6,48.46 70.1,47.96 71.73,47.96 72.34,47.35 73.36,47.35 73.56,47.14 73.56,45.72 PROGRAMMING.3 | U2.47 76.65,52.83 77.01,52.83 77.42,53.24 80.38,53.24 C5.2 | 73.28,56.21 U2.47 | 73.28,56.21 73.3,56.24 v73.41,56.24 | 81.89,51.73 C5.2 | 81.69,51.6 C5.2 | 45.11,36.17 v45.31,36.37 | 68.89,55.88 68.89,56.33 U2.20
  Top 0.305: 70.51,20.22 70.31,20.02 | 71.53,20.42 71.73,20.42 72.83,21.52 | 71.53,20.42 v71.12,20.42 71.04,20.42 70.88,20.58 | 67.97,20.32 68.07,20.42 v68.68,20.42 69.09,20.42 | 71.53,20.42 | 71.53,19.81 IO1.21 | U3.6 U3.5 U3.4 U3.3 U3.2 41.55,44.91 42.27,44.91 42.53,45.17 U3.23 U3.22 | U1.13 44.89,32.13 | 44.89,32.13 45.11,31.9 45.11,31.27 U1.12 U1.11 U1.10 U1.9 45.13,28.67 44.91,28.45 44.28,28.45 U1.8 44.26,26.49 C19.1 44.3,26.38 44.3,25.81 | C18.1 46.16,33.4 44.89,32.13 | U1.4 41.43,27.84 41.23,27.64 C17.1 | 44.3,25.4 44.09,25.2 | C32.2 66.44,56.66 U2.23
  Top 0.406: 71.73,20.42 71.53,20.22 71.53,19.81 72.18,20.46 IO1.3 | IO1.2 72.83,21.72 71.53,20.42 | IO1.5 70.88,20.58 70.51,20.22 | IO1.15 67.63,19.98 67.97,20.32 | IO1.8 68.93,20.58 69.09,20.42 | C21.2 84.77,62.89 C22.2 84.77,59.45 v84.84,59.39 84.26,58.81 R4.2 | UART.4 61.21,50.95 | 61.21,50.95 61.16,51 57.71,51 56.08,49.38 53.85,49.38 50.19,45.72 v46.74,45.72 | v24.28,48.97 23.37,48.97 23.06,49.28 | 73.15,56.49 72.75,56.08 72.75,54.86 72.14,54.25 71.53,54.25 71.32,54.46 69.9,55.88 68.89,55.88 68.48,55.88 68.07,55.47 67.46,54.86 65.73,54.86 v65.48,54.61 65.33,54.46 64.82,54.46 63.77,53.4 C6.2 61.21,51.78 61.21,50.95 | C27.1 C26.1 45.96,42.03 v45.92,42.06 | v45.31,36.37 44.5,36.37 44.09,36.78 44.09,37.76 C23.1 | R5.2 48.7,36.92 48.16,36.37 v45.31,36.37 | 42.53,45.17 43.02,45.17 v43.48,44.7 | C18.1 46.16,35.52 v45.31,36.37 | 44.3,25.4 44.3,25.81 | 44.09,25.2 41.86,25.2 41.25,25.81 41.25,29.12 U1.4
  Top 0.61: X1.5 19.48,19.18 v18.39,18.09 | 6.6,54.31 5.26,55.65 LED12.C 5.33,56.72 5.33,58.88 5.04,59.17 | RESET.2 5.04,59.17 | RESET.1 9.14,59.17 | 9.14,59.17 5.04,59.17 | 9.14,59.17 9.25,59.27 USER.2 USER.1 20.43,59.36 20.43,60.63 LED11.C 23.8,62.56 24.54,61.82 | 48.97,64.47 28.45,64.47 27.94,63.96 27.94,63.91 26.62,62.59 25.3,62.59 24.54,61.82 | 24.54,61.82 24.38,61.67 24.38,61.16 24.64,60.91 24.64,60.59 R45.1 | 24.13,60.15 24.7,60.15 R45.1 | C25.1 71.68,63.5 v72.14,63.96 | Q2MMBF170-7-F.2 24.86,58.66 24.38,59.13 24.38,60.34 R45.1 | 48.97,64.47 48.62,64.11 SV2.11 SV2.12 | 48.97,64.47 v61.21,64.47 | 75.27,63.51 C15.2 76.1,63.96 v76.76,63.3 76.61,63.14 76.61,62.38 v75.18,60.96
  Top 1.27: 63.6,20.42 v67.46,20.42 | 69.09,20.42 63.91,20.42 v62.99,21.34 62.28,20.63 C7.- | IC2.2 19.81,49.02 | 19.81,49.02 21.08,49.02 | 21.08,49.02 21.34,49.02 | 21.34,49.02 22.81,49.02 | 22.81,49.02 22.86,48.97 22.86,48.55 C10.2 | C11.2 21.23,49.17 21.08,49.02 | C9.2 21.23,48.92 21.34,49.02 | C12.2 23.11,49.33 23.06,49.28 22.81,49.02 | C8.- 17.88,55.42 16.76,54.31 6.6,54.31 5.84,54.31 5.84,43.89 16.26,43.89 16.26,44.4 | 16.26,44.4 16.26,49.48 | 16.26,54.05 16.26,49.48 | 16.26,49.48 16.76,48.97 19.76,48.97 19.81,49.02 | SV1.1 16.92,43.74 16.26,44.4 | v72.34,20.42 72.49,20.27 73.91,20.27 76.71,17.48 C1.2 C2.2
  Bottom 0.406: C16.2 C20.1 8.53,29.67 | v45.31,36.37 45.92,36.98 v45.92,42.06 45.92,44.3 45.72,44.5 | v43.48,44.7 45.52,44.7 45.72,44.5 | 32.92,16.26 32.71,16.05 | 45.72,16.26 45.52,16.05 | 49.78,16.26 49.58,16.05 | 57.1,16.26 57.3,16.05 | v46.74,45.72 46.74,45.52 45.72,44.5 | I2C_EXT.1 28.04,36.58 26.82,37.8 26.82,46.13 27.63,46.94
  Bottom 0.61: C14.2 22.45,20.79 U11.2 22.45,17.98 22.66,17.78 | R10.2 18.39,16.39 | 19.51,16.76 R10.2 | 22.66,17.78 21.13,17.78 20.22,16.87 19.98,16.87 R10.2 | v18.39,18.09 18.39,16.39 | 77.22,63.96 v72.14,63.96 71.63,64.47 v61.21,64.47 | 77.22,63.96 83.91,63.96 C21.2 84.87,59.42 v84.84,59.39 | 22.66,17.78 25.26,17.78 C13.2 | v75.18,60.96 73.36,59.13 73.36,56.29 v73.41,56.24 | v76.76,63.3 76.76,63.5 77.22,63.96 | 11.79,17.27 17.51,17.27 18.39,16.39 | SV3.1 27.63,46.94 26.31,46.94 v24.28,48.97
  Bottom 1.27: v62.99,21.34 62.99,18.9 60.15,16.05 57.3,16.05 49.58,16.05 45.52,16.05 32.71,16.05 28.04,16.05 24.99,13.01 12.19,13.01 11.79,13.41 11.79,17.27 10.97,18.09 5.89,18.09 5.08,18.9 5.08,20.17 | SV1.1 19.51,43.89 11.68,43.89 8.53,40.74 8.53,29.67 v8.53,23.17 8.53,22.96 6.1,20.52 5.44,20.52 5.08,20.17 | 5.08,20.17 JP1.1
  other vias: 77.22,19.56 75.18,19.56 75.18,21.64 77.22,21.64 69.9,20.42 13,32.72 4.47,32.72 7.52,43.13 14.38,43.13 14.12,55.32 7.52,55.32 10.82,55.32 10.82,42.88 5.49,61.42 19.96,61.42 4.47,37.29 4.47,29.67 1.93,28.65 1.93,32.72 1.93,37.29 13,28.65 20.62,28.65 20.62,32.72 79.25,19.56 79.25,21.59 28.5,49.07 27.03,30.43 59.79,30.02 82.04,32.82 84.84,32.82 84.79,37.39 82.04,37.39 82.04,28.75 84.58,28.75 83.06,65.13 55.93,44.45 36.02,56.44 36.02,50.55 33.17,53.39 5.69,65.07 14.63,62.64 71.37,50.95 27.08,35.51 59.79,35.92 13,37.59 75.74,33.02 64.36,33.43 70.87,37.8 64.36,37.8 72.49,28.55 84.18,14.33 7.32,17.68 48.36,30.07 52.07,36.53 38.2,41.66 31.34,43.03 52.88,41.2 56.74,19.66 32.36,37.74 51.26,53.19 67.01,64.92 30.89,13.46 55.07,13.46 37.19,30.43 41.45,24.33 30.33,19.86
  pour Bottom: -8.53,77.62 95.1,77.62 95.71,-4.47 -7.92,-4.47
  pour Top: -13.41,82.3 97.13,82.3 97.74,-9.14 -12.8,-9.14
IR_CONTROLL  (via drill 0.6)
  Top 0.254: v69.49,54.81 69.49,54.01 U2.29
  Bottom 0.254: SV2.1 35.15,62.54 34.8,62.18 34.8,58.88 35.31,58.37 36.07,58.37 37.59,56.85 39.37,56.85 39.88,56.34 40.39,55.83 41.76,54.46 61.77,54.46 65.63,58.32 66.24,58.32 66.85,57.71 68.68,57.71 69.49,56.9 v69.49,54.81
LED_1  (via drill 0.6)
  Top 0.254: 67.6,52.77 U2.28 66.45,51.65 v66.45,51.44 | v54.66,50.39 53.85,50.39 52.43,48.97 50.19,48.97 47.55,51.61 47.55,52.02 v47.35,52.22 | 31.28,55.88 R28.2 31.28,55.47 37.59,55.47 v38,55.88
  Bottom 0.254: v66.45,51.44 66.07,51.82 64.41,51.82 63.8,51.21 57.71,51.21 56.9,50.39 v54.66,50.39 | v47.35,52.22 41.25,52.22 40.03,53.44 40.03,54.66 38.81,55.88 v38,55.88
M1  (via drill 0.6)
  Top 0.254: IO1.14 66.98,16.13 66.8,15.95 65.79,15.95 65.28,16.46 64.31,16.46 v64.21,16.56 | U2.40 73.52,51.04 75.39,49.17 77.01,49.17 79.65,46.53 79.65,45.92 v79.86,45.72
  Bottom 0.254: v79.86,45.72 79.86,45.11 77.01,42.27 77.01,37.59 73.36,33.93 68.48,33.93 67.56,33.02 67.56,30.43 62.99,25.86 62.99,24.59 64.21,23.37 v64.21,16.56
N$1
  Top 0.305: IO1.4 71.53,25.7
  Top 0.406: 71.53,25.7 71.53,25.71
  Top 0.61: 71.53,25.71 71.53,26.52 68.68,29.36 63.04,29.36 61.65,30.75 U$1.P$1
N$2
  Top 0.305: IO1.6 70.23,26.4
  Top 0.406: 70.23,26.4 69.09,27.53
  Top 0.61: 69.09,27.53 68.28,28.35 68.25,28.33 61.91,28.33 U$1.P$2
N$3
  Top 0.305: IO1.9 68.28,25.5
  Top 0.406: 68.28,25.5 67.56,26.21 67.46,26.31
  Top 0.61: 67.56,26.21 67.16,26.62 64.26,26.62 60.35,22.71 60.35,18.9 58.12,16.66 29.26,16.66 29.03,16.89 28.98,16.89 26.42,19.46 26.42,27 25.6,27.82 U$2.P$1
N$4
  Top 0.305: IO1.7 69.58,25.42
  Top 0.406: 69.58,25.42 67.67,27.33
  Top 0.61: 67.87,27.13 67.67,27.33 67.46,27.53 63.65,27.53 59.94,23.83 59.94,23.8 59.18,23.04 59.18,19.28 57.86,17.96 57.81,17.96 57.53,17.68 29.67,17.68 27.69,19.66 27.69,19.71 27.33,20.07 27.33,27.74 25.15,29.92 25.15,37.78 U$2.P$2
N$5
  Top 0.254: IO1.17 68.93,16.3 68.58,15.95 68.33,15.95 67.82,15.44 67.82,14.94 67.56,14.68 66.77,14.68 C3.2
N$6
  Top 0.305: U3.7 42.03,42.24 40.84,41.05 40.84,38 41.05,37.8 C23.2
N$7
  Top 0.305: U3.8 42.53,39.93 C24.2
N$8
  Top 0.305: IO1.24 IO1.23 IO1.22
N$9  (via drill 0.6)
  Top 0.254: R1.2 81.69,18.59 v81.28,19
  Top 0.305: IO1.1 74.17,23.67 v74.57,23.27
  Bottom 0.305: v74.57,23.27 74.78,23.47 77.72,23.47 78.23,22.96 78.23,20.93 78.64,20.52 79.76,20.52 v81.28,19
N$13
  Top 0.305: U3.9 43.03,41.09 43.08,41.05 43.69,41.05 43.89,40.84 43.89,40.07 C24.1
N$14
  Top 0.305: C32.1 65.45,58.36 U2.22
N$16  (via drill 0.6)
  Top 0.254: R4.1 81.7,56.91 79.86,55.07 77.62,55.07 v77.42,54.86 | v73.56,54.25 73.56,53.81 U2.44 | 84.84,54.61 84.84,54.41 BOOT.2
  Top 0.406: R4.1 84.52,56.91 84.84,56.59 84.84,54.61
  Bottom 0.254: v77.42,54.86 74.17,54.86 v73.56,54.25
N$17
  Bottom 0.254: U11.1 21.41,19.15 21.34,19.23
  Bottom 0.305: 21.51,19.23 21.34,19.23 20.6,19.23 20.52,19.3 20.52,22.59 R44.2
N$18
  Top 0.254: R17.1 46.19,40.44 45.72,40.44 44.7,41.45 43.89,41.45 43.53,41.81 U3.10
  Top 0.305: 46.33,40.3 R17.1 R5.1
N$19
  Top 0.305: U1.14 43.61,33.48 C18.2 R16.2
N$20
  Top 0.305: C17.2 38.37,30.04 39.62,31.29 39.62,33.46 R16.1
N$22
  Top 0.254: IO1.20 70.88,15.46 C4.2
N$23
  Top 0.305: R27.2 1.83,56.57 LED12.A
N$24  (via drill 0.6)
  Top 0.305: v22.76,26.01 22.76,24.38 v24.18,22.96
  Bottom 0.254: LED13.C 22.17,25.43 v22.76,26.01
  Bottom 0.406: R44.1 v24.18,22.96
N$26
  Top 0.406: SV1.3 24.74,45.87 25.6,46.74 25.6,55.39 Q2MMBF170-7-F.3
  Bottom 0.61: SV1.3 24.74,41.21 R2.1
N$33  (via drill 0.6)
  Top 0.254: LED11.A 22.35,57.91 23.16,57.1 v24.38,57.1 | v27.63,55.07 28.77,55.07 R28.1
  Bottom 0.254: v24.38,57.1 24.79,56.69 24.79,56.08 25.6,55.27 27.43,55.27 v27.63,55.07
N$53
  Bottom 0.254: LED13.A 13.57,22.38 R6.2
  Bottom 0.61: U11.3 23.42,19.15 23.88,19.61 23.88,20.79 C14.1 24.12,20.83 25.4,20.83 25.7,21.13 25.7,23.88 25.09,24.49 19.91,24.49 17.76,22.33 R6.2
N$54
  Bottom 0.61: U11.5 21.51,14.81 21.13,14.43 19.57,14.43 R10.1
N$55  (via drill 0.6)
  Top 0.305: R7.1 26.62,53.44 26.42,53.24 26.42,42.47 25.6,41.66 25.4,41.66 17.07,33.33 v17.07,27.43 17.08,27.42 X1.2
  Bottom 0.305: C20.2 17.07,29.5 v17.07,27.43
N$56  (via drill 0.6)
  Top 0.305: R8.1 28.67,51.41 27.23,51.41 27.03,51.21 27.03,41.66 26.42,41.05 25.81,41.05 18.29,33.53 v18.29,31.5 18.29,26.82 17.88,26.42 X1.3
  Bottom 0.305: C16.1 v18.29,31.5
N$57  (via drill 0.6)
  Top 0.406: 16.26,21.26 X1.1
  Top 0.61: 16.26,21.26 16.26,19.3 16.87,18.69 16.87,17.17 17.78,16.26 19.91,16.26 21.13,17.48 23.85,17.48 24.31,17.02 24.31,14.5 v24.23,14.43 | v14.83,27.64 14.83,25.2 16.26,23.77 16.26,21.31 X1.1
  Bottom 0.61: C13.1 U11.4 24.21,16.41 24.31,16.31 24.31,14.5 v24.23,14.43 | D1.A 14.63,27.43 v14.83,27.64
OSCIN
  Top 0.254: C22.1 81.38,61.01 81.03,60.66 81.03,59.19 Q1.3 | Q1.3 81.01,60.17 | Q1.3 81.01,58.35 80.57,57.91 77.62,57.91 77.17,58.37 76.01,58.37 U2.5
OSCOUT
  Top 0.254: C21.1 82.86,62.99 81.79,61.93 78.84,61.93 | Q1.1 78.61,62.16 78.84,61.93 | 78.84,61.93 78.84,61.57 76.2,58.93 75.85,58.93 U2.6
RESET  (via drill 0.6)
  Top 0.254: 65.62,63.96 R15.1 | 8.35,63.67 RESET.3 9.65,63.68 9.65,64.72 10.16,65.23 60.35,65.23 60.76,65.63 64.62,65.63 65.57,64.68 R15.1 | 68.77,63.9 69.09,64.35 69.09,64.72 69.6,65.23 76.61,65.23 77.62,64.21 77.62,61.77 v76.61,60.76 76.61,60.41 U2.7 | 68.77,63.9 C25.2 | R15.1 68.37,63.5 68.77,63.9
  Top 0.305: RESET.4 RESET.3
  Bottom 0.254: PROGRAMMING.1 68.43,50.75 69.49,51.82 74.57,51.82 77.01,49.38 77.62,49.38 78.23,49.99 78.23,50.8 76.81,52.22 76.81,53.65 77.01,53.85 77.83,53.85 78.44,54.46 78.44,55.27 75.39,58.32 75.39,59.54 v76.61,60.76
SCL  (via drill 0.6)
  Top 0.254: 73.5,52.43 U2.42 73.3,52.63 v72.34,52.63 | U3.21 43.53,47.55 43.53,51.66 44.91,53.04 47.75,53.04 v48.97,51.82
  Top 0.305: U1.2 40.52,30.6 40.23,30.89 40.23,31.9 v40.84,32.51 | v36.78,38.41 39.01,38.41 v40.84,36.58 | R14.1 44.87,47.35 v44.3,47.35 43.73,47.35 43.53,47.55
  Bottom 0.254: v72.34,52.63 69.7,52.63 68.48,53.85 64.01,53.85 63.6,53.44 63.6,52.02 63.2,51.61 59.94,51.61 59.54,52.02 57.71,52.02 57.1,52.63 53.64,52.63 52.22,51.21 51,51.21 50.8,51.41 49.38,51.41 v48.97,51.82 | I2C_EXT.3 33.53,41.66 v36.78,38.41
  Bottom 0.305: v40.84,32.51 v40.84,36.58 40.84,44.66 43.53,47.35 v44.3,47.35
SDA  (via drill 0.6)
  Top 0.254: U2.43 76.25,50.39 77.01,50.39 v77.22,50.6 | 42.98,47.24 43.06,47.33 43.06,48.16 43.08,48.18 43.08,50.6 | 42.88,47.14 42.27,47.14 42.06,46.94 42.06,46.2 U3.24 | 43.08,50.6 43.08,52.02 44.5,53.44 48.56,53.44 50.39,51.61 52.63,51.61 53.85,52.83 59.13,52.83 v59.94,53.65 | R13.1 42.88,50.8 43.08,50.6
  Top 0.305: U1.3 40.11,29.95 v39.62,29.46 | v40.64,47.14 42.88,47.14 42.98,47.24
  Bottom 0.254: v77.22,50.6 74.57,53.24 73.15,53.24 72.75,53.65 71.53,53.65 70.92,53.04 69.9,53.04 66.24,56.69 64.82,56.69 61.77,53.65 v59.94,53.65 | I2C_EXT.4 39.12,44.2 39.62,44.7
  Bottom 0.305: v39.62,29.46 39.62,44.7 39.62,46.13 v40.64,47.14
SERVO  (via drill 0.6)
  Top 0.254: 27.43,58.47 Q2MMBF170-7-F.1 28.04,57.83 v28.04,56.9 | v74.78,42.67 76.4,42.67 78.64,44.91 v78.64,45.52 | v80.06,56.69 79.25,56.69 78.44,55.88 77.62,55.88 76.81,56.69 76.45,56.69 U2.2
  Top 0.406: 26.6,60.15 R45.2 26.57,60.4 27.43,59.54 27.43,58.47
  Bottom 0.254: v78.64,45.52 78.64,46.13 79.45,46.94 79.45,51.41 79.86,51.82 79.86,56.49 v80.06,56.69 | v74.78,42.67 72.75,42.67 71.12,41.05 58.93,41.05 58.73,41.25 58.73,44.91 57.71,45.92 53.64,45.92 51.21,48.36 49.78,48.36 48.16,49.99 40.64,49.99 38.2,52.43 38.2,53.44 38,53.65 35.97,53.65 35.56,53.24 35.56,52.02 33.32,49.78 31.7,49.78 28.65,52.83 28.65,56.29 v28.04,56.9
SWCLK
  Top 0.254: PROGRAMMING.4 76.05,46.36 U2.37
SWDIO
  Top 0.254: U2.34 68.58,49.54 68.58,48.46 70.97,46.08 PROGRAMMING.2
UART_RX
  Top 0.254: U2.31 66.04,49.12 66.04,47.96 62.99,44.91 UART.2
UART_TX
  Top 0.254: U2.30 63.65,47.45 UART.3
USBDM  (via drill 0.6)
  Top 0.254: U2.32 66.65,49.01 66.65,47.75 63.6,44.7 v63.6,44.3 | v31.9,53.24 30.11,53.24 R7.2
  Bottom 0.254: v31.9,53.24 31.29,52.63 31.29,51 31.9,50.39 33.12,50.39 34.95,52.22 34.95,53.65 35.56,54.25 38.61,54.25 38.81,54.05 38.81,52.83 41.05,50.6 48.16,50.6 49.78,48.97 51.41,48.97 53.64,46.74 59.13,46.74 59.74,46.13 62.79,46.13 63.4,45.52 63.4,44.5 v63.6,44.3
USBDP  (via drill 0.6)
  Top 0.254: U2.33 67.06,48.74 67.06,47.55 64.62,45.11 64.62,43.89 64.01,43.28 63.2,43.28 62.79,43.69 59.54,43.69 59.13,44.09 59.13,46.13 57.51,47.75 v54.86,47.75
  Top 0.305: v32.31,51.21 30.77,51.21 R8.2
  Bottom 0.254: R9.2 34.36,54.86 39.01,54.86 39.42,54.46 39.42,53.24 41.25,51.41 47.95,51.41 49.99,49.38 52.22,49.38 53.85,47.75 v54.86,47.75
  Bottom 0.305: 32.32,51.22 v32.31,51.21
  Bottom 0.406: R9.2 34.14,53.04 v32.31,51.21
USER_KEY_1  (via drill 0.6)
  Top 0.254: USER.3 18.86,63.77 v18.03,62.94 16.51,61.42 R3.2 | U2.46 76.55,52.22 78.64,52.22 v78.84,52.43
  Top 0.305: 20.27,63.7 USER.3
  Bottom 0.254: v18.03,62.94 18.03,57.61 23.88,51.77 28.91,51.77 31.29,49.38 33.73,49.38 35.76,51.41 38.41,51.41 40.44,49.38 47.75,49.38 49.38,47.75 50.8,47.75 53.24,45.31 57.3,45.31 58.12,44.5 58.12,40.84 58.52,40.44 71.32,40.44 72.95,42.06 73.97,42.06 74.37,41.66 75.18,41.66 75.59,42.06 75.59,43.28 76,43.69 76.61,43.69 77.22,44.3 77.22,47.35 77.83,47.96 78.64,47.96 79.05,48.36 79.05,52.22 v78.84,52.43
VCC
  Top 0.254: C7.+ 62.28,13.11 62.38,13.01
  Top 0.305: 69.58,14.43 C3.1
  Top 0.406: 10.97,20.02 10.67,20.02 10.57,20.12 | IO1.18 69.58,14.68 C3.1 70.23,15.33 IO1.19
  Top 1.27: 69.49,14.3 C3.1 69.34,14.2 69.34,12.9 69.09,12.65 | 62.38,13.01 62.89,13.01 63.25,12.65 69.09,12.65 | IC2.1 21.12,46.48 C9.1 22.1,46.6 | 22.1,46.6 C10.1 | 22.1,46.6 22.2,46.5 SV1.2 22.15,43.69 22.15,41.25 21.54,40.64 11.99,40.64 10.57,39.22 10.57,20.12 10.57,15.04 10.26,14.73 | 69.09,12.65 76.2,12.65 76.71,13.16 C1.1 C2.1 R1.1 | C7.+ 60.99,15.44 27.43,15.44 24.99,13.01 11.99,13.01 10.26,14.73 | S1.3 10.21,14.68 10.26,14.73
  Bottom 0.61: R2.2 22.57,42.15 22.35,42.37
  Bottom 1.27: 22.35,41.86 22.35,42.37 22.35,43.59 SV1.2
(copper drawn outside any net)
  shapes: Top area x5